# EAGLE design motherboard (EAGLE 5.06)
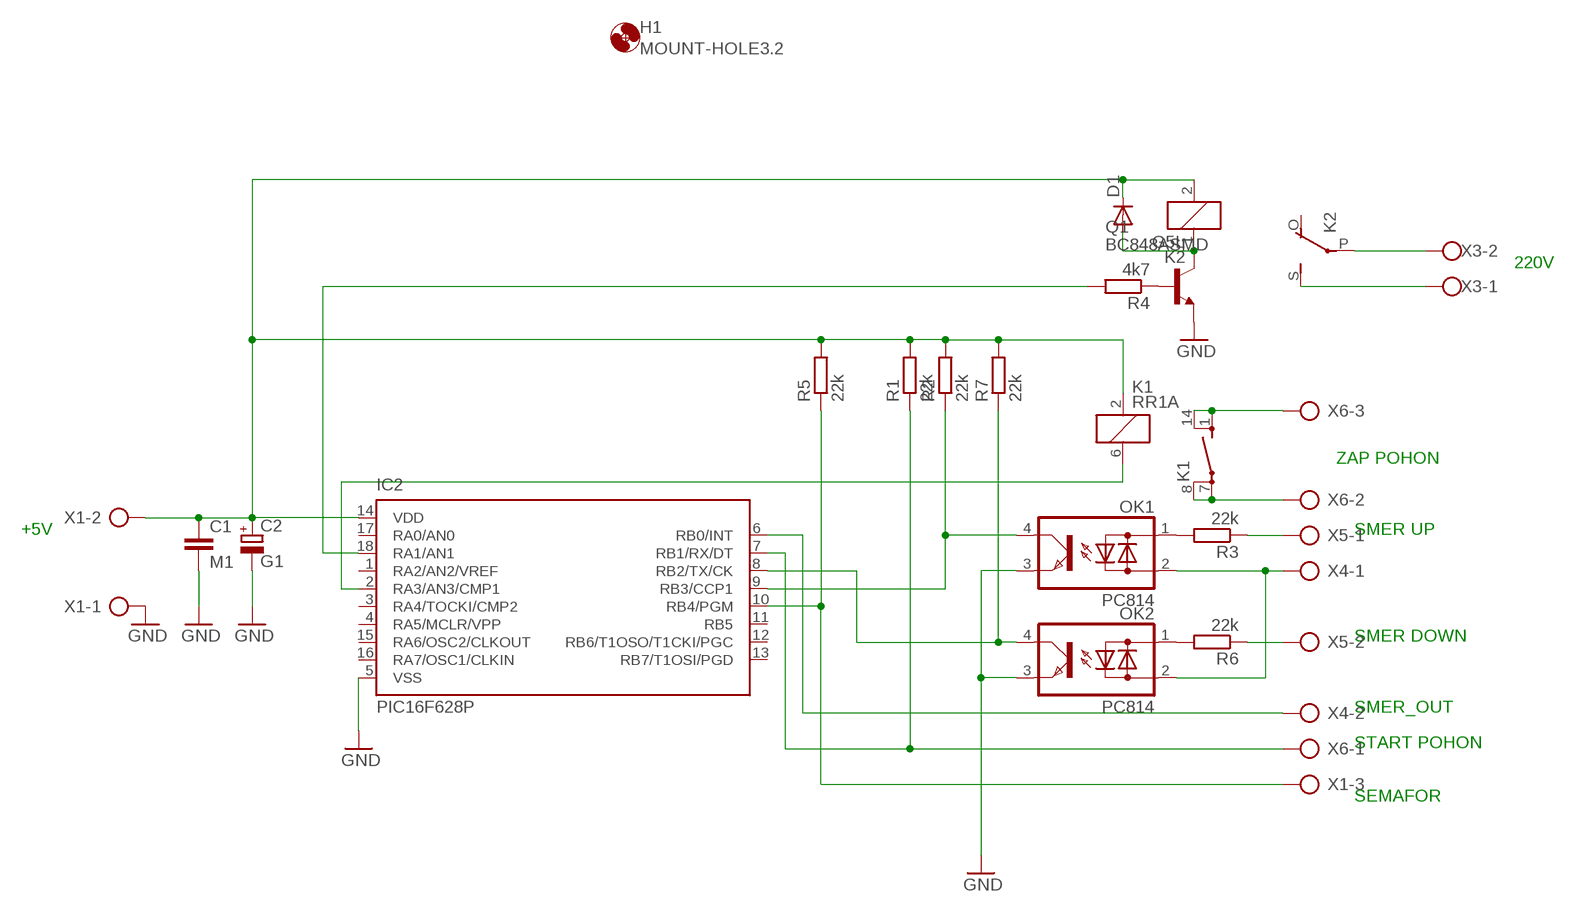
[diagram p0: schematic, sheet 1]

## Parts
C1  M1  C-EUC1206  [C1206]
C2  G1  CPOL-EUE3.5-8  [E3,5-8]
D1  DIODE-D-7.5  [D-7.5]
H1  MOUNT-HOLE3.2  [3,2]
IC2  PIC16F628P  [DIL18]
K1  RR1A  [RR1A]
K2  G5L  [G5LE]
OK1  PC814  [DIL04]
OK2  PC814  [DIL04]
Q1  BC848ASMD  [SOT23]
R1  22k  R-EU_R1206  [R1206]
R2  22k  R-EU_R1206  [R1206]
R3  22k  R-EU_R1206  [R1206]
R4  4k7  R-EU_R1206  [R1206]
R5  22k  R-EU_R1206  [R1206]
R6  22k  R-EU_R1206  [R1206]
R7  22k  R-EU_R1206  [R1206]
X1  AK500/3  [AK500/3]
X3  W237-102  [W237-102]
X4  AK500/2  [AK500/2]
X5  AK500/2  [AK500/2]
X6  AK500/3  [AK500/3]

## Nets
GND: C1.2 C2.- IC2.5(VSS) OK1.3(E) OK2.3(E) Q1.2(E) X1.1
N$1: C1.1 C2.+ D1.C IC2.14(VDD) K1.2 K2.2 R1.2 R2.2 R5.2 R7.2 X1.2
N$2: IC2.7(RB1/RX/DT) R1.1 X6.1
N$3: IC2.8(RB2/TX/CK) OK2.4(C) R7.1
N$4: OK2.1(AC1) R6.2
N$5: OK1.1(AC1) R3.2
N$6: OK1.2(AC2) OK2.2(AC2) X4.1
N$7: K1.7(2:P) K1.8(2:P) X6.2
N$8: R6.1 X5.2
N$9: R3.1 X5.1
N$10: IC2.6(RB0/INT) X4.2
N$11: D1.A K2.1 Q1.3(C)
N$12: Q1.1(B) R4.1
N$13: IC2.18(RA1/AN1) R4.2
N$14: K2.P(2:P) X3.2
N$15: K2.S(2:S) X3.1
N$16: IC2.10(RB4/PGM) R5.1 X1.3
N$17: K1.1(2:S) K1.14(2:S) X6.3
N$19: IC2.2(RA3/AN3/CMP1) K1.6
N$20: IC2.9(RB3/CCP1) OK1.4(C) R2.1
Unconnected: IC2.1(RA2/AN2/VREF) IC2.3(RA4/TOCKI/CMP2) IC2.4(RA5/MCLR/VPP) IC2.11(RB5) IC2.12(RB6/T1OSO/T1CKI/PGC) IC2.13(RB7/T1OSI/PGD) IC2.15(RA6/OSC2/CLKOUT) IC2.16(RA7/OSC1/CLKIN) IC2.17(RA0/AN0) K2.O(2:O)

## Notes on the sheet
- 220V
- ZAP POHON
- +5V | SMER UP
- SMER DOWN
- SMER_OUT
- START POHON
- SEMAFOR

## Library data of the parts
C1 = rcl:C-EU: CAPACITOR, European symbol
C2 = rcl:CPOL-EU: POLARIZED CAPACITOR, European symbol
D1 = diode:DIODE-: DIODE
H1 = holes:MOUNT-HOLE: MOUNTING HOLE with drill center marker
IC2 = microchip:PIC16F62*: FLASH-Based 8-Bit CMOS Microcontroller Source: http://ww1.microchip.com/downloads/en/DeviceDoc/40300C.pdf
K1 = relay:RR1A: RELAY reed, polarity, 1 x norm. open with shield
K2 = relay:G5L: RELAY 1 x switch, 10 A/120 V AC, 8 A/30 V ADC, Omron
OK1 OK2 = optocoupler:PC814: SHARP OPTO COUPLER
Q1 = transistor-npn:BC848*: NPN Transistor
R1-R7 = rcl:R-EU_: RESISTOR, European symbol
X1 X6 = con-ptr500:AK500/3: CONNECTOR
X3 = con-wago-500:W237-102: WAGO SCREW CLAMP
X4 X5 = con-ptr500:AK500/2: CONNECTOR

## Board
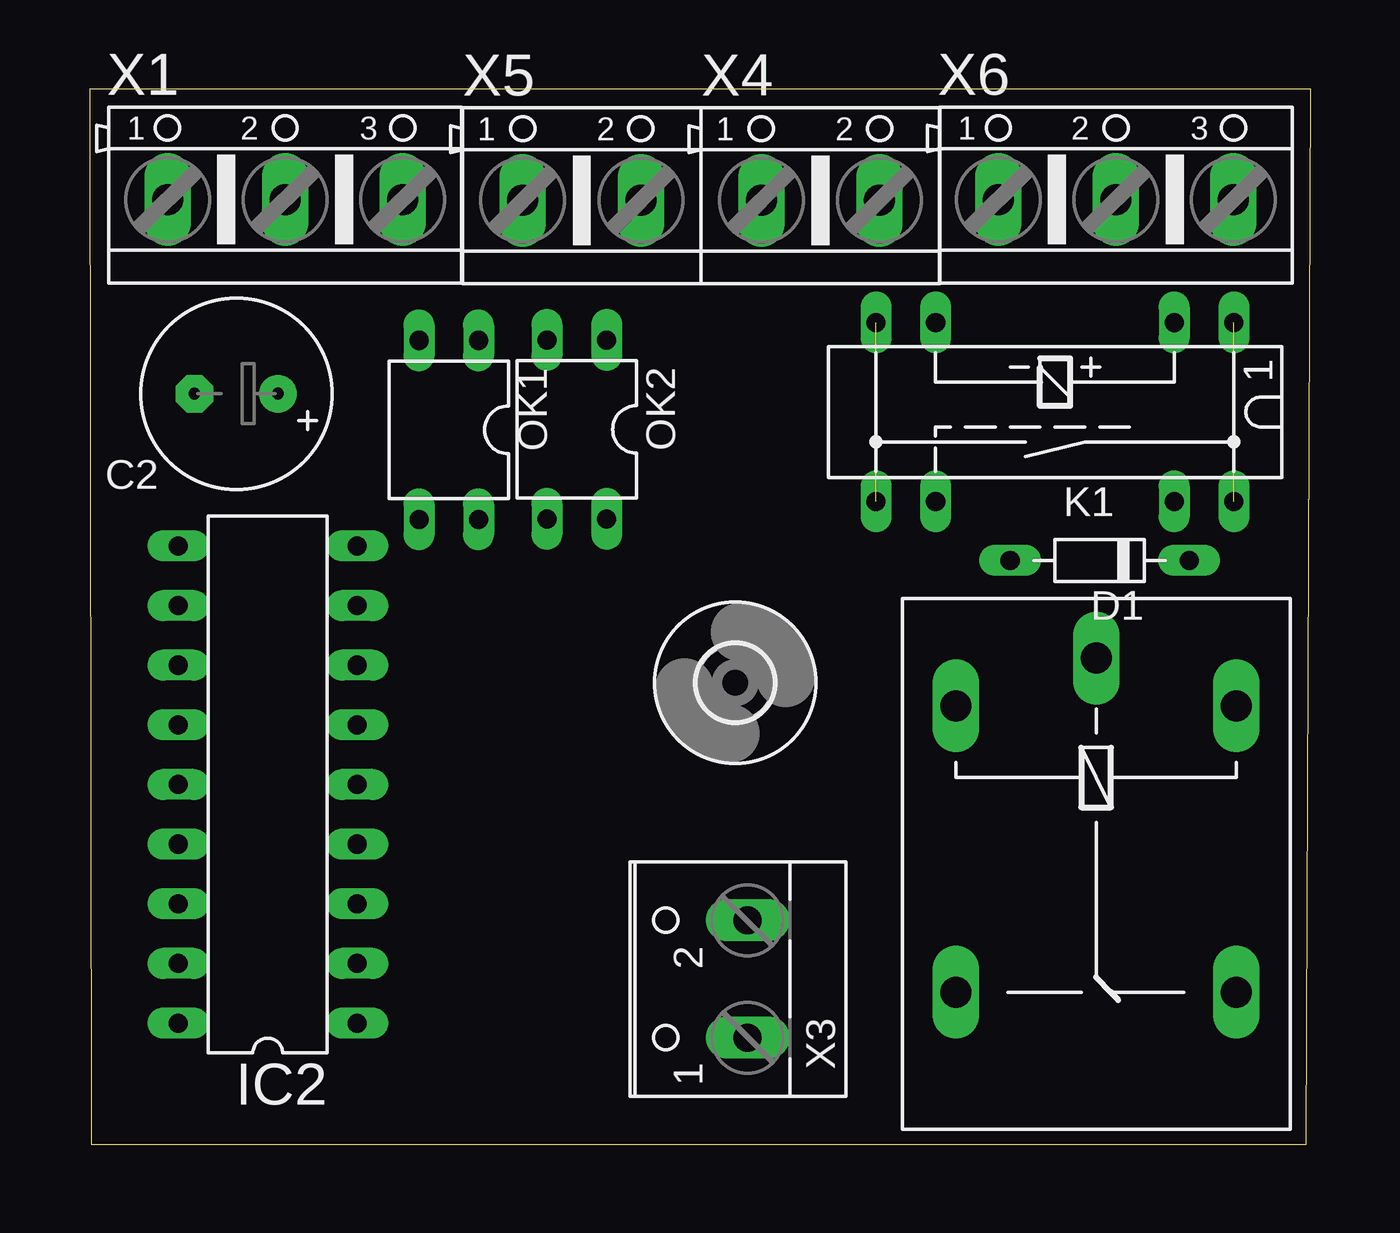
[diagram p1: board, top side]
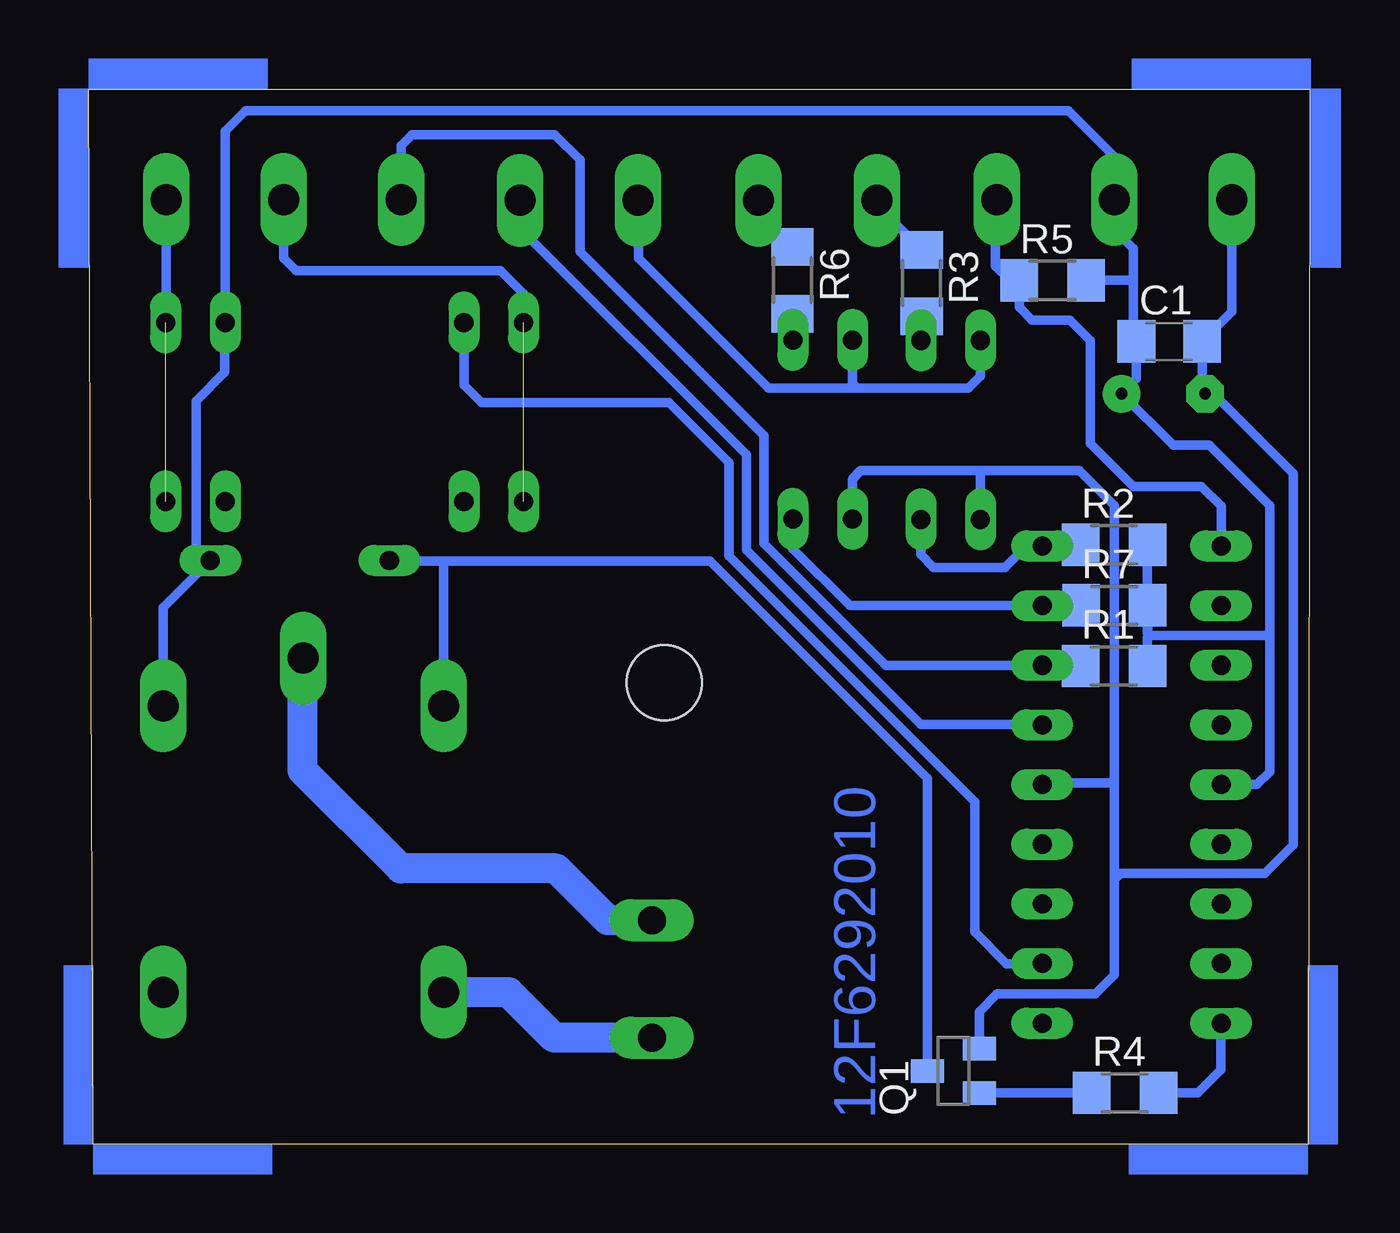
[diagram p2: board, bottom side, seen from below]

Size 52 x 44.92 mm. Coordinates in mm from the lower left corner, seen from the top.
Outline: 0.07,0 51.8,0 52,44.92 0,44.92 0.07,0
Copper layers (1*16): Top 0.035mm / dielectric 1.5mm / Bottom 0.035mm
Design rules "default": minimum track width 10mil, minimum drill 24mil, track to track 8mil, track to pad 8mil, pad to pad 8mil, via to via 8mil, smd to smd 8mil, copper to edge 40mil, drill to drill 8mil, minimum pad ring 10mil, minimum via ring 8mil, stop-mask expansion 4mil, vias tented up to drill 0mil, thermal gap 10mil

### Footprints (pad centres in the part's own frame; a part is rotated, then mirrored left to right if it is on the bottom)
C1206 = smd 1.6 x 1.8: 1 -1.4,0; 2 1.4,0
E3,5-8 = drill 0.5 pad 1.6 round: + -1.778,0 | drill 0.5 pad 1.6 octagon: - 1.778,0
D-7.5 = drill 0.813 long: A 3.81,0; C -3.81,0
3,2 = hole 3.2: 0,0
DIL18 = drill 0.813 long: 1 -10.16,-3.81; 2 -7.62,-3.81; 3 -5.08,-3.81; 4 -2.54,-3.81; 5 0,-3.81; 6 2.54,-3.81; 7 5.08,-3.81; 8 7.62,-3.81; 9 10.16,-3.81; 10 10.16,3.81; 11 7.62,3.81; 12 5.08,3.81; 13 2.54,3.81; 14 0,3.81; 15 -2.54,3.81; 16 -5.08,3.81; 17 -7.62,3.81; 18 -10.16,3.81
RR1A = drill 0.813 long: 1 -7.62,-3.81; 2 -5.08,-3.81; 6 5.08,-3.81; 7 7.62,-3.81; 8 7.62,3.81; 9 5.08,3.81; 13 -5.08,3.81; 14 -7.62,3.81
G5LE = drill 1.321 long: 1 -7.493,-5.969; 2 -7.493,5.969; O 4.699,5.969; P -9.525,0; S 4.699,-5.969
DIL04 = drill 0.813 long: 1 -1.27,-3.81; 2 1.27,-3.81; 3 1.27,3.81; 4 -1.27,3.81
SOT23 = smd 1 x 1.4: 1 -0.95,-1.1; 2 0.95,-1.1; 3 0,1.1
R1206 = smd 1.6 x 1.803: 1 -1.422,0; 2 1.422,0
AK500/3 = drill 1.321 long: 1 -5.004,0; 2 0,0; 3 5.004,0
W237-102 = drill 1.194 long: 1 -2.5,-1.27; 2 2.5,-1.27
AK500/2 = drill 1.321 long: 1 -2.515,0; 2 2.515,0

### Placement (x,y rotation side)
C1  5.99,34.18 0 bottom
C2  6.24,31.96 180 top
D1  43,24.86 180 top
H1  27.48,19.66 0 top
IC2  7.58,15.32 90 top
K1  41.1,31.18 180 top
K2  42.85,11.17 270 top
OK1  15.29,30.42 180 top
OK2  20.75,30.44 180 top
Q1  15.18,3.13 90 bottom
R1  8.34,20.37 0 bottom
R2  8.34,25.53 0 bottom
R3  16.53,36.67 270 bottom
R4  7.87,2.19 0 bottom
R5  10.96,36.78 0 bottom
R6  22.03,36.78 270 bottom
R7  8.33,22.95 0 bottom
U$1  [ANGLE-ARROW-NW1]  -0.05,44.95 0 top
U$2  [ANGLE-ARROW-NW1]  51.8,0 180 top
U$3  [ANGLE-ARROW-NW1]  52,44.95 270 top
U$4  [ANGLE-ARROW-NW1]  0.09,0 90 top
X1  8.33,40.23 0 top
X3  26.74,7.04 90 top
X4  31.12,40.2 0 top
X5  20.96,40.2 0 top
X6  43.7,40.23 0 top

### Tracks (layer width: path | path; a pad name or v marks a point on that pad's centre or on a via)
GND
  Bottom 0.406: IC2.5 11.33,15.39 8.39,15.39 8.33,15.46 | X1.1 3.32,35.45 C1.2 4.59,32.09 | 4.59,32.09 C2.- | Q1.2 14.08,5.65 13.32,6.41 9.14,6.41 8.33,7.22 8.33,11.27 | 8.33,11.27 8.33,15.46 | 8.33,15.46 8.33,27.2 9.81,28.69 14,28.69 | 4.59,32.09 4.24,32.09 0.7,28.55 0.7,12.75 1.91,11.54 8.06,11.54 8.33,11.27 | OK2.3 19.48,28.34 19.12,28.69 14,28.69 | OK1.3 14.02,28.66 14,28.69
N$1
  Bottom 0.406: 7.51,36.65 7.51,34.31 C1.1 7.39,32.59 C2.+ 5.82,29.77 4.28,29.77 1.71,27.2 1.71,21.8 | 7.51,36.65 7.51,38.13 8.33,38.95 X1.2 8.33,42.05 10.28,44.01 45.31,44.01 46.18,43.14 K1.2 46.19,32.87 47.41,31.66 47.41,25.46 D1.C 48.82,22.85 K2.2 | R5.2 7.65,36.78 7.51,36.65 | 6.92,21.94 R2.2 | IC2.14 2.25,15.32 1.71,15.86 1.71,21.8 | R7.2 6.9,21.95 6.92,21.94 | 6.92,21.94 6.92,21.74 6.84,21.67 | 6.84,21.67 1.85,21.67 1.71,21.8 | R1.2 6.92,21.59 6.84,21.67
N$2
  Bottom 0.406: 26.48,33.41 25.94,32.87 | 26.48,33.41 31.07,38 31.07,41.91 32.15,42.99 38.23,42.99 38.7,42.52 X6.1 | R1.1 11.36,20.37 IC2.7 11.41,20.38 18.05,20.38 23.24,25.58 23.24,30.17 26.48,33.41
N$3
  Bottom 0.406: R7.1 9.75,22.94 IC2.8 19.59,22.94 22.03,25.38 22.03,26.62 OK2.4
N$4
  Bottom 0.254: R6.2 21.61,35.62 21.61,34.35 OK2.1
N$5
  Bottom 0.254: 16.53,35.62 R3.2 16.53,34.35 OK1.1
N$6
  Bottom 0.406: OK1.2 14.02,32.71 14.53,32.2 19.26,32.2 | 19.26,32.2 23.04,32.2 28.57,37.73 28.57,40.17 X4.1 | OK2.2 19.48,32.41 19.26,32.2
N$7  (1 unrouted)
  Bottom 0.406: K1.7 33.48,36.22 34.45,37.19 43.16,37.19 43.69,37.73 X6.2
N$8
  Bottom 0.406: X5.2 23.47,39.65 R6.1
N$9
  Bottom 0.406: X5.1 18.44,40 R3.1
N$10
  Bottom 0.406: X4.2 33.64,39.01 23.98,29.36 23.98,25.31 16.56,17.89 11.42,17.89 IC2.6
N$11
  Bottom 0.406: 37.42,24.84 36.88,24.84 36.88,24.83 K2.1 | 37.42,24.84 39.17,24.84 D1.A | Q1.3 16.29,3.14 16.29,15.59 25.54,24.84 37.42,24.84
N$12
  Bottom 0.406: R4.1 14.06,2.19 Q1.1
N$13
  Bottom 0.406: R4.2 4.78,2.19 3.8,3.17 3.8,5.13 IC2.18
N$14
  Bottom 1.27: X3.2 29.88,9.54 32.08,11.74 38.7,11.74 42.88,15.93 42.88,20.67 K2.P
N$15
  Bottom 1.27: X3.1 32.17,4.54 34.11,6.48 K2.S
N$16
  Bottom 0.406: X1.3 13.39,40.17 13.39,37.39 12.78,36.78 R5.1 12.37,35.64 11.83,35.1 10.22,35.1 9.34,34.22 9.34,29.83 7.51,28.01 4.61,28.01 3.77,27.17 IC2.10
N$17  (1 unrouted)
  Bottom 0.406: X6.3 48.7,35.01 K1.1
N$19
  Bottom 0.406: K1.6 36,34.97 36,32.33 35.26,31.59 27.29,31.59 24.73,29.02 24.73,25.04 14.26,14.58 14.26,9.04 12.92,7.69 11.4,7.69 IC2.2 11.47,7.62
N$20
  Bottom 0.406: R2.1 11.35,25.53 IC2.9 12.07,25.48 12.98,24.57 16.02,24.57 16.56,25.11 OK1.4

### Text on the board
Bottom: 12F6292010